# Altium schematic sheet Clock_And_Delay.SchDoc
size A3; ApprovedBy: Mateusz Kowalik; CheckedBy: Mateusz Kowalik; Author: Mateusz Kowalik; CompanyName: InMotion Labs sp. z o.o.; DrawnBy: Mateusz Kowalik; Engineer: Mateusz Kowalik; Organization: InMotion Labs sp. z o.o.; Address1: Rydlówka 5A; Address2: 30-363 Kraków; Address4: Poland; Revision: Rev 0; SheetNumber: 4; SheetTotal: 11
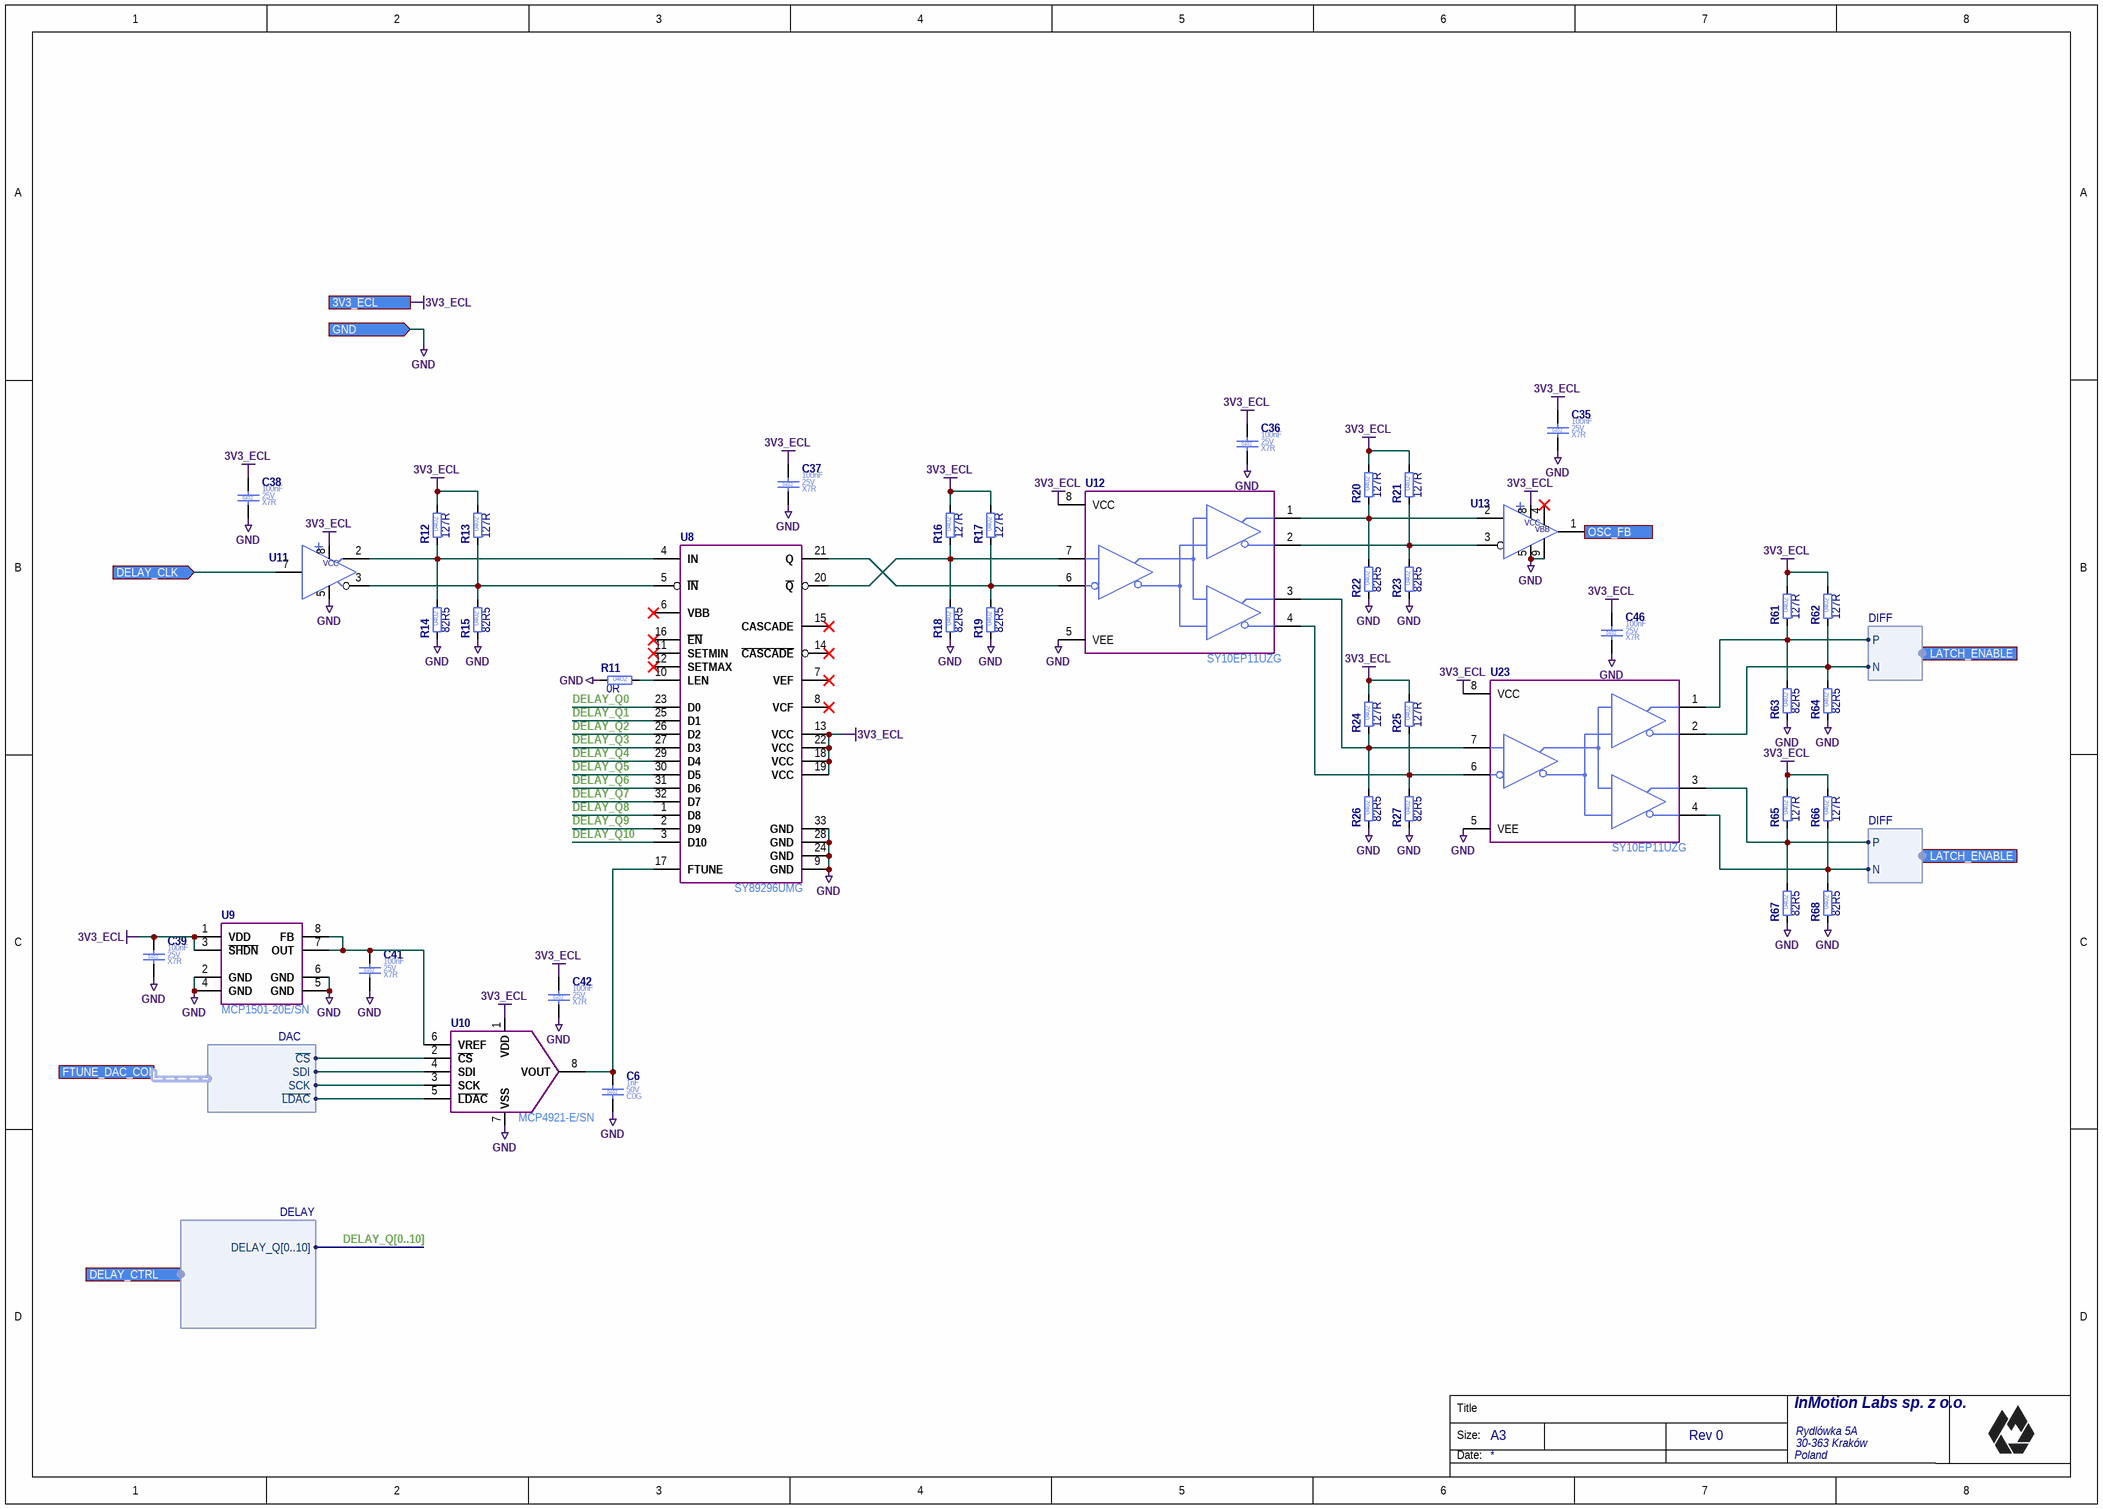
[diagram p0: Clock_And_Delay.SchDoc]

## Parts
C6  Case/Package: 0402  Voltage Rating (DC): 50V  Dielectric: C0G  Capacitance: 1nF  [C_0402_1005]  (hidden comment: C_1NF_50V_C0G_0402_5)
C35  Case/Package: 0402  Voltage Rating (DC): 25V  Dielectric: X7R  Capacitance: 100nF  [C_0402_1005]  (hidden comment: C_100NF_25V_X7R_0402_10)
C36  Case/Package: 0402  Voltage Rating (DC): 25V  Dielectric: X7R  Capacitance: 100nF  [C_0402_1005]  (hidden comment: C_100NF_25V_X7R_0402_10)
C37  Case/Package: 0402  Voltage Rating (DC): 25V  Dielectric: X7R  Capacitance: 100nF  [C_0402_1005]  (hidden comment: C_100NF_25V_X7R_0402_10)
C38  Case/Package: 0402  Voltage Rating (DC): 25V  Dielectric: X7R  Capacitance: 100nF  [C_0402_1005]  (hidden comment: C_100NF_25V_X7R_0402_10)
C39  Case/Package: 0402  Voltage Rating (DC): 25V  Dielectric: X7R  Capacitance: 100nF  [C_0402_1005]  (hidden comment: C_100NF_25V_X7R_0402_10)
C41  Case/Package: 0402  Voltage Rating (DC): 25V  Dielectric: X7R  Capacitance: 100nF  [C_0402_1005]  (hidden comment: C_100NF_25V_X7R_0402_10)
C42  Case/Package: 0402  Voltage Rating (DC): 25V  Dielectric: X7R  Capacitance: 100nF  [C_0402_1005]  (hidden comment: C_100NF_25V_X7R_0402_10)
C46  Case/Package: 0402  Voltage Rating (DC): 25V  Dielectric: X7R  Capacitance: 100nF  [C_0402_1005]  (hidden comment: C_100NF_25V_X7R_0402_10)
R11  Resistance: 0R  Case/Package: 0402  [R_0402_1005]  (hidden comment: R_0R_0402_1)
R12  Resistance: 127R  Case/Package: 0402  [R_0402_1005]  (hidden comment: R_127R_0402_1)
R13  Resistance: 127R  Case/Package: 0402  [R_0402_1005]  (hidden comment: R_127R_0402_1)
R14  Resistance: 82R5  Case/Package: 0402  [R_0402_1005]  (hidden comment: R_82R5_0402_1)
R15  Resistance: 82R5  Case/Package: 0402  [R_0402_1005]  (hidden comment: R_82R5_0402_1)
R16  Resistance: 127R  Case/Package: 0402  [R_0402_1005]  (hidden comment: R_127R_0402_1)
R17  Resistance: 127R  Case/Package: 0402  [R_0402_1005]  (hidden comment: R_127R_0402_1)
R18  Resistance: 82R5  Case/Package: 0402  [R_0402_1005]  (hidden comment: R_82R5_0402_1)
R19  Resistance: 82R5  Case/Package: 0402  [R_0402_1005]  (hidden comment: R_82R5_0402_1)
R20  Resistance: 127R  Case/Package: 0402  [R_0402_1005]  (hidden comment: R_127R_0402_1)
R21  Resistance: 127R  Case/Package: 0402  [R_0402_1005]  (hidden comment: R_127R_0402_1)
R22  Resistance: 82R5  Case/Package: 0402  [R_0402_1005]  (hidden comment: R_82R5_0402_1)
R23  Resistance: 82R5  Case/Package: 0402  [R_0402_1005]  (hidden comment: R_82R5_0402_1)
R24  Resistance: 127R  Case/Package: 0402  [R_0402_1005]  (hidden comment: R_127R_0402_1)
R25  Resistance: 127R  Case/Package: 0402  [R_0402_1005]  (hidden comment: R_127R_0402_1)
R26  Resistance: 82R5  Case/Package: 0402  [R_0402_1005]  (hidden comment: R_82R5_0402_1)
R27  Resistance: 82R5  Case/Package: 0402  [R_0402_1005]  (hidden comment: R_82R5_0402_1)
R61  Resistance: 127R  Case/Package: 0402  [R_0402_1005]  (hidden comment: R_127R_0402_1)
R62  Resistance: 127R  Case/Package: 0402  [R_0402_1005]  (hidden comment: R_127R_0402_1)
R63  Resistance: 82R5  Case/Package: 0402  [R_0402_1005]  (hidden comment: R_82R5_0402_1)
R64  Resistance: 82R5  Case/Package: 0402  [R_0402_1005]  (hidden comment: R_82R5_0402_1)
R65  Resistance: 127R  Case/Package: 0402  [R_0402_1005]  (hidden comment: R_127R_0402_1)
R66  Resistance: 127R  Case/Package: 0402  [R_0402_1005]  (hidden comment: R_127R_0402_1)
R67  Resistance: 82R5  Case/Package: 0402  [R_0402_1005]  (hidden comment: R_82R5_0402_1)
R68  Resistance: 82R5  Case/Package: 0402  [R_0402_1005]  (hidden comment: R_82R5_0402_1)
U8  SY89296UMG  [QFN50P500X500X100_HS-33N]
U9  Manufacturer Part Number: MCP1501-20E/SN  [SOIC127P600X170-8N]  (hidden comment: MCP1501_SOIC)
U10  MCP4921-E/SN  [SOIC127P600X170-8N]
U11  MC100LVELT20DG  [SOIC127P600X170-8N]  (value not drawn)
U12  SY10EP11UZG  [SOIC127P600X170-8N]
U13  MC100EPT21MNR4G  [SON50P200X80_HS-9N]  (value not drawn)
U23  SY10EP11UZG  [SOIC127P600X170-8N]

## Ports
3V3_ECL (in), DELAY_CLK (in), DELAY_CTRL (harness DELAY), FTUNE_DAC_CONTROL (harness DAC), GND (in), LATCH_ENABLE (harness DIFF), OSC_FB (out)

## Harnesses
DAC: ~{CS}, SDI, SCK, ~{LDAC}
DIFF: P, N
DELAY: DELAY_Q[0..10]

## Nets
3V3_ECL: C35.1 C36.1 C37.1 C38.1 C39.1 C42.1 C46.1 R12.2 R13.2 R16.2 R17.2 R20.2 R21.2 R24.2 R25.2 R61.2 R62.2 R65.2 R66.2 U8.13(VCC) U8.18(VCC) U8.19(VCC) U8.22(VCC) U9.1(VDD) U9.3(~{SHDN}) U10.1(VDD) U11.8(VCC) U12.8(VCC) U13.8(VDD) U23.8(VCC) ; port 3V3_ECL
GND: C6.2 C35.2 C36.2 C37.2 C38.2 C39.2 C41.2 C42.2 C46.2 R11.1 R14.1 R15.1 R18.1 R19.1 R22.1 R23.1 R26.1 R27.1 R63.1 R64.1 R67.1 R68.1 U8.9(GND) U8.24(GND) U8.28(GND) U8.33(GND) U9.2(GND) U9.4(GND) U9.5(GND) U9.6(GND) U10.7(VSS) U11.5(VSS) U12.5(VEE) U13.5(VSS) U13.9(VSS) U23.5(VEE) ; port GND
DELAY_CLK: U11.7(D) ; port DELAY_CLK
DELAY_Q0: U8.23(D0)
DELAY_Q1: U8.25(D1)
DELAY_Q2: U8.26(D2)
DELAY_Q3: U8.27(D3)
DELAY_Q4: U8.29(D4)
DELAY_Q5: U8.30(D5)
DELAY_Q6: U8.31(D6)
DELAY_Q7: U8.32(D7)
DELAY_Q8: U8.1(D8)
DELAY_Q9: U8.2(D9)
DELAY_Q10: U8.3(D10)
OSC_FB: U13.1(OUTA) ; port OSC_FB
NetC6_1: C6.1 U8.17(FTUNE) U10.8(VOUT)
NetC41_1: C41.1 U9.7(OUT) U9.8(FB) U10.6(VREF)
NetR11_2: R11.2 U8.10(LEN)
NetR12_1: R12.1 R14.2 U8.4(IN) U11.2(Q)
NetR13_1: R13.1 R15.2 U8.5(~{IN}) U11.3(~{Q})
NetR16_1: R16.1 R18.2 U8.20(~{Q}) U12.7(D)
NetR17_1: R17.1 R19.2 U8.21(Q) U12.6(~{D})
NetR20_1: R20.1 R22.2 U12.1(Q0) U13.2(D)
NetR21_1: R21.1 R23.2 U12.2(/Q0) U13.3(~{D})
NetR24_1: R24.1 R26.2 U12.3(Q1) U23.7(D)
NetR25_1: R25.1 R27.2 U12.4(~{Q1}) U23.6(~{D})
NetR61_1: R61.1 R63.2 R65.1 R67.2 U23.1(Q0) U23.3(Q1) ; port LATCH_ENABLE.P
NetR62_1: R62.1 R64.2 R66.1 R68.2 U23.2(/Q0) U23.4(~{Q1}) ; port LATCH_ENABLE.N
NetU10_2: U10.2(~{CS}) ; port FTUNE_DAC_CONTROL.~{CS}
NetU10_3: U10.3(SCK) ; port FTUNE_DAC_CONTROL.SCK
NetU10_4: U10.4(SDI) ; port FTUNE_DAC_CONTROL.SDI
NetU10_5: U10.5(~{LDAC}) ; port FTUNE_DAC_CONTROL.~{LDAC}

Not connected (* = marked no-connect by the designer): U8 6(VBB)* 7(VEF)* 8(VCF)* 11(SETMIN)* 12(SETMAX)* 14(~{CASCADE})* 15(CASCADE)* 16(~{EN})*; U11 1(NC) 4(NC) 6(NC); U13 4(VDD)*

## Buses and harness runs
bus DELAY_Q[0..10]

## Notes on the sheet
- Title
- Size:
- Date:
- A3
- (in symbol MC100EPT21MNR4G) VCC; VBB

## Library data of the parts
C6 = C_1NF_50V_C0G_0402_5: Ceramic Capacitor; Manufacturer Part Number: UMK105CG102JV-F; Manufacturer: Taiyo Yuden; Value: 1nF; Tolerance: 5%; Part Number: C_1NF_50V_C0G_0402_5; Mount: Surface Mount; Height: 500um; HelpURL: https://pl.mouser.com/datasheet/2/396/mlcc02_e-1307760.pdf; RoHS: Compliant; Max Operating Temperature: 125°C; Status: AK; Supplier 1: Mouser; Supplier Part Number 1: 963-JMK212ABJ106KG-T
C35-C39 C41 C42 C46 = C_100NF_25V_X7R_0402_10: Ceramic Capacitor; Manufacturer Part Number: EMK105B7104KV-F; Manufacturer: Taiyo Yuden; Value: 100nF; Tolerance: 10%; Part Number: C_100NF_25V_X7R_0402_10; Mount: Surface Mount; Height: 500um; HelpURL: https://pl.mouser.com/datasheet/2/396/mlcc02_e-1307760.pdf; RoHS: Compliant; Max Operating Temperature: 125°C; Status: AK; Supplier 1: Mouser; Supplier Part Number 1: 963-EMK105B7104KV-F
R11 = R_0R_0402_1: Thick Film Resistor; Manufacturer: Yageo; Manufacturer Part Number: RC0402FR-070RL; Value: 0R; Tolerance: 1%; Voltage Rating (DC): 50V; Power Rating: 63mW; Stats: MK; Part Number: R_0R_0402_1; Mount: Surface Mount; Height: 350um; HelpURL: http://datasheet.octopart.com/2176049-1-TE-Connectivity---AMP-datasheet-11120217.pdf; RoHS: Compliant; Max Operating Temperature: 155°C; Supplier 1: Mouser; Supplier Part Number 1: 603-RC0402FR-070RL
R12 R13 R16 R17 R20 R21 R24 R25 R61 R62 R65 R66 = R_127R_0402_1: Thick Film Resistor; Manufacturer: Yageo; Manufacturer Part Number: RC0402FR-07127RL; Value: 127R; Tolerance: 1%; Voltage Rating (DC): 50V; Power Rating: 63mW; Stats: MK; Part Number: R_127R_0402_1; Mount: Surface Mount; Height: 350um; HelpURL: https://pl.mouser.com/datasheet/2/447/PYu_RC_Group_51_RoHS_L_10-1664068.pdf; RoHS: Compliant; Max Operating Temperature: 155°C; Supplier 1: Mouser; Supplier Part Number 1: 603-RC0402FR-07127RL
R14 R15 R18 R19 R22 R23 R26 R27 R63 R64 R67 R68 = R_82R5_0402_1: Thick Film Resistor; Manufacturer: Yageo; Manufacturer Part Number: RC0402FR-0782R5L; Value: 82R5; Tolerance: 1%; Voltage Rating (DC): 50V; Power Rating: 63mW; Stats: MK; Part Number: R_82R5_0402_1; Mount: Surface Mount; Height: 350um; HelpURL: https://pl.mouser.com/datasheet/2/447/PYu-RC_Group_51_RoHS_L_10-1527934.pdf; RoHS: Compliant; Max Operating Temperature: 155°C; Supplier 1: Mouser; Supplier Part Number 1: 603-RC0402FR-0782R5L
U8 = SY89296UMG: Delay Lines/Timing Elements 2.5V/3.3V PECL Delay Line; Manufacturer: Microchip; Max Frequency: 1.5GHz; Max Supply Current: 220mA; Max Supply Voltage: 3.6V; Min Supply Voltage: 2.375V; Part Number: SY89296UMG; Case/Package: QFN32; Mount: Surface Mount; Height: 0.9mm; HelpURL: https://datasheet.octopart.com/SY89296UTG-Microchip-datasheet-11975343.pdf; Logic Function: Delay Line; Marking: SY89296U; Max Operating Temperature: 85°C; Number of Pins: 32; RoHS: Compliant; Status: MK; Manufacturer Part Number: SY89296UMG; Supplier 1: Mouser; Supplier Part Number 1: 998-SY89296UMG
U9 = MCP1501-20E/SN: 2.048V Voltage References Precision Buffered Voltage Reference; Manufacturer: Microchip Technology; Tolerance: 0.1; Output Current: 20mA; Max Input Voltage: 5.5V; Output Type: Fixed; Reference Type: Series; Part Number: MCP1501-20E/SN; Case/Package: SOIC8; Max Output Current: 20mA; Max Output Voltage: 2.048V; Max Operating Temperature: 125°C; Min Output Voltage: 2.048V; Min Operating Temperature: -40°C; Mount: Surface Mount; Height: 1.45mm; HelpURL: https://pl.mouser.com/datasheet/2/268/20005474C-961722.pdf; Lead Free: Lead Free; Length: 2.9mm; Number of Pins: 6; Output Voltage: 2.048V; REACH SVHC: No SVHC; Reference Voltage: 2.048V; RoHS: Compliant; Width: 1.55mm; Status: MK; Supplier 1: Mouser; Supplier Part Number 1: 579-MCP1501-20E/SN
U10 = MCP4921-E/SN: 1 Channel DAC 12 bit; Manufacturer: Microchip; Polarity: Unipolar; Interface: SPI; Max Supply Voltage: 5.5; Min Supply Voltage: 2.7; Resolution: 12bit; Sampling Rate: 450kHz; Part Number: MCP4921-E/SN; Manufacturer Part Number: MCP4921-E/SN; Case/Package: SO8; Mount: Surface Mount; Height: 1.75mm; HelpURL: https://ww1.microchip.com/downloads/en/DeviceDoc/22248a.pdf; Max Operating Temperature: 125; RoHS: Compliant; Status: MK
U11 = MC100LVELT20DG: LVTTL/LVCMOS to Differential LVPECL Translator; Manufacturer: ON Semiconductor; Output Current: 100mA; Marking: KVT20; Max Supply Voltage: 3.6V; Min Supply Voltage: 3V; Part Number: MC100LVELT20DG; Case/Package: SOIC8; Max Output Current: 100mA; Mount: Surface Mount; Height: 1.75mm; HelpURL: https://pl.mouser.com/datasheet/2/308/MC100LVELT20_D-1811115.pdf; Max Operating Temperature: 85°C; RoHS: Compliant; Status: MK; Manufacturer Part Number: MC100LVELT20DG; Supplier 1: Mouser; Supplier Part Number 1: 863-MC100LVELT20DG
U12 U23 = SY10EP11UZG: 1:2 PECL Fanout Buffer; Manufacturer: Microchip; Max Output Current: 100mA; Marking: Z8-1; Max Supply Voltage: 3.6V; Min Supply Voltage: 3.0V; Part Number: SY10EP11UZG; Case/Package: SOIC8; Mount: Surface Mount; Height: 1.75mm; HelpURL: https://datasheet.octopart.com/SY10EP11UZG-Microchip-datasheet-39498.pdf; Max Operating Temperature: 85°C; RoHS: Compliant; Status: MK; Manufacturer Part Number: SY10EP11UZG; Supplier 1: Mouser; Supplier Part Number 1: 998-SY10EP11UZG
U13 = MC100EPT21MNR4G: Differential LVPECL/LVDS/CML to LVTTL/LVCMOS Translator; Manufacturer: ON Semiconductor; Output Current: 24mA; Marking: 3RM; Max Supply Voltage: 3.8V; Min Supply Voltage: 3.3V; Part Number: MC100EPT21MNR4G; Case/Package: DFN-8; Max Output Current: 24mA; Mount: Surface Mount; Height: 1mm; HelpURL: https://datasheet.octopart.com/MC100EPT21MNR4G-ON-Semiconductor-datasheet-12520234.pdf; Max Operating Temperature: 85°C; RoHS: Compliant; Status: MK; Manufacturer Part Number: MC100EPT21MNR4G; Supplier 1: Mouser; Supplier Part Number 1: 863-MC100EPT21MNR4G